# EAGLE design monroe-half-hi (EAGLE 6.3)
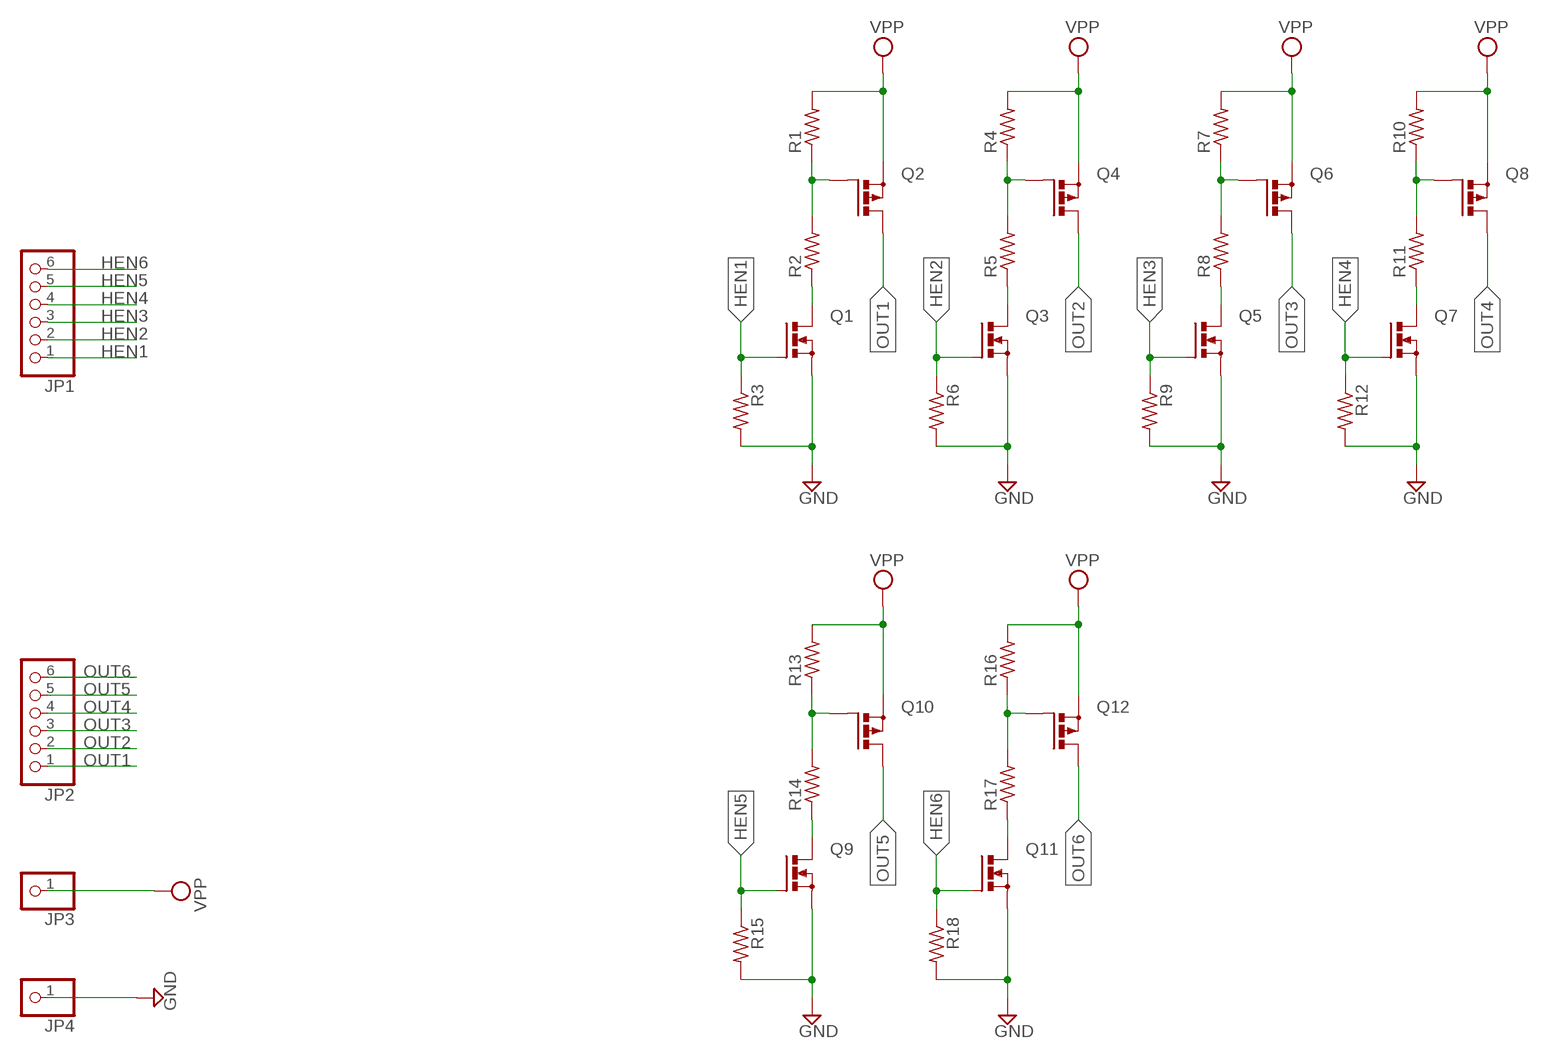
[diagram p0: schematic, sheet 1]

## Parts
JP1  PINHD-1X6  [1X06]
JP2  PINHD-1X6  [1X06]
JP3  PINHD-1X1  [1X01]
JP4  PINHD-1X1  [1X01]
Q1  PMOSFET_NTO220BV  [TO220BV]
Q2  PMOSFET_PTO220BV  [TO220BV]
Q3  PMOSFET_NTO220BV  [TO220BV]
Q4  PMOSFET_PTO220BV  [TO220BV]
Q5  PMOSFET_NTO220BV  [TO220BV]
Q6  PMOSFET_PTO220BV  [TO220BV]
Q7  PMOSFET_NTO220BV  [TO220BV]
Q8  PMOSFET_PTO220BV  [TO220BV]
Q9  PMOSFET_NTO220BV  [TO220BV]
Q10  PMOSFET_PTO220BV  [TO220BV]
Q11  PMOSFET_NTO220BV  [TO220BV]
Q12  PMOSFET_PTO220BV  [TO220BV]
R1  R-US_0207/5V  [0207/5V]
R2  R-US_0207/10  [0207/10]
R3  R-US_0207/5V  [0207/5V]
R4  R-US_0207/5V  [0207/5V]
R5  R-US_0207/10  [0207/10]
R6  R-US_0207/5V  [0207/5V]
R7  R-US_0207/5V  [0207/5V]
R8  R-US_0207/10  [0207/10]
R9  R-US_0207/5V  [0207/5V]
R10  R-US_0207/5V  [0207/5V]
R11  R-US_0207/10  [0207/10]
R12  R-US_0207/5V  [0207/5V]
R13  R-US_0207/5V  [0207/5V]
R14  R-US_0207/10  [0207/10]
R15  R-US_0207/5V  [0207/5V]
R16  R-US_0207/5V  [0207/5V]
R17  R-US_0207/10  [0207/10]
R18  R-US_0207/5V  [0207/5V]

## Nets
GND: JP4.1 Q1.S Q3.S Q5.S Q7.S Q9.S Q11.S R3.2 R6.2 R9.2 R12.2 R15.2 R18.2
HEN1: JP1.1 Q1.G R3.1
HEN2: JP1.2 Q3.G R6.1
HEN3: JP1.3 Q5.G R9.1
HEN4: JP1.4 Q7.G R12.1
HEN5: JP1.5 Q9.G R15.1
HEN6: JP1.6 Q11.G R18.1
N$1: Q2.G R1.1 R2.2
N$2: Q1.D R2.1
N$3: Q4.G R4.1 R5.2
N$4: Q3.D R5.1
N$5: Q6.G R7.1 R8.2
N$6: Q5.D R8.1
N$7: Q8.G R10.1 R11.2
N$8: Q7.D R11.1
N$9: Q10.G R13.1 R14.2
N$10: Q9.D R14.1
N$11: Q12.G R16.1 R17.2
N$12: Q11.D R17.1
OUT1: JP2.1 Q2.D
OUT2: JP2.2 Q4.D
OUT3: JP2.3 Q6.D
OUT4: JP2.4 Q8.D
OUT5: JP2.5 Q10.D
OUT6: JP2.6 Q12.D
VPP: JP3.1 Q2.S Q4.S Q6.S Q8.S Q10.S Q12.S R1.2 R4.2 R7.2 R10.2 R13.2 R16.2

## Library data of the parts
JP1 JP2 = pinhead:PINHD-1X6: PIN HEADER
JP3 JP4 = pinhead:PINHD-1X1: PIN HEADER
Q1 Q3 Q5 Q7 Q9 Q11 = transistor-power:PMOSFET_N: Power MOSFET N-Channel
Q2 Q4 Q6 Q8 Q10 Q12 = transistor-power:PMOSFET_P: Power MOSFET P-Channel
R1 R3 R4 R6 R7 R9 R10 R12 R13 R15 R16 R18 = rcl:R-US_: RESISTOR, American symbol
R2 R5 R8 R11 R14 R17 = resistor:R-US_: RESISTOR, American symbol

## Board
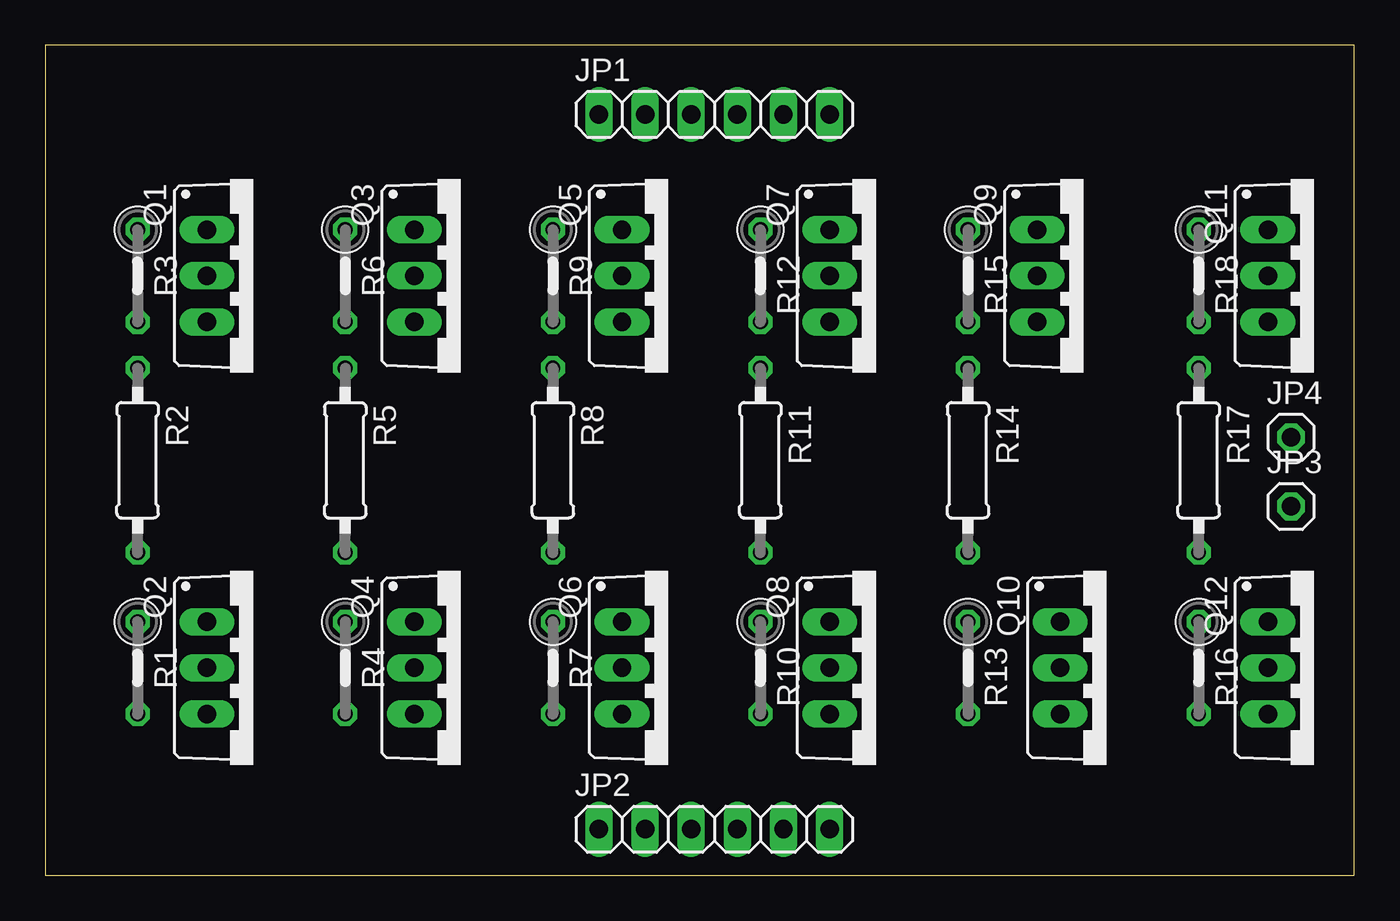
[diagram p1: board, top side]
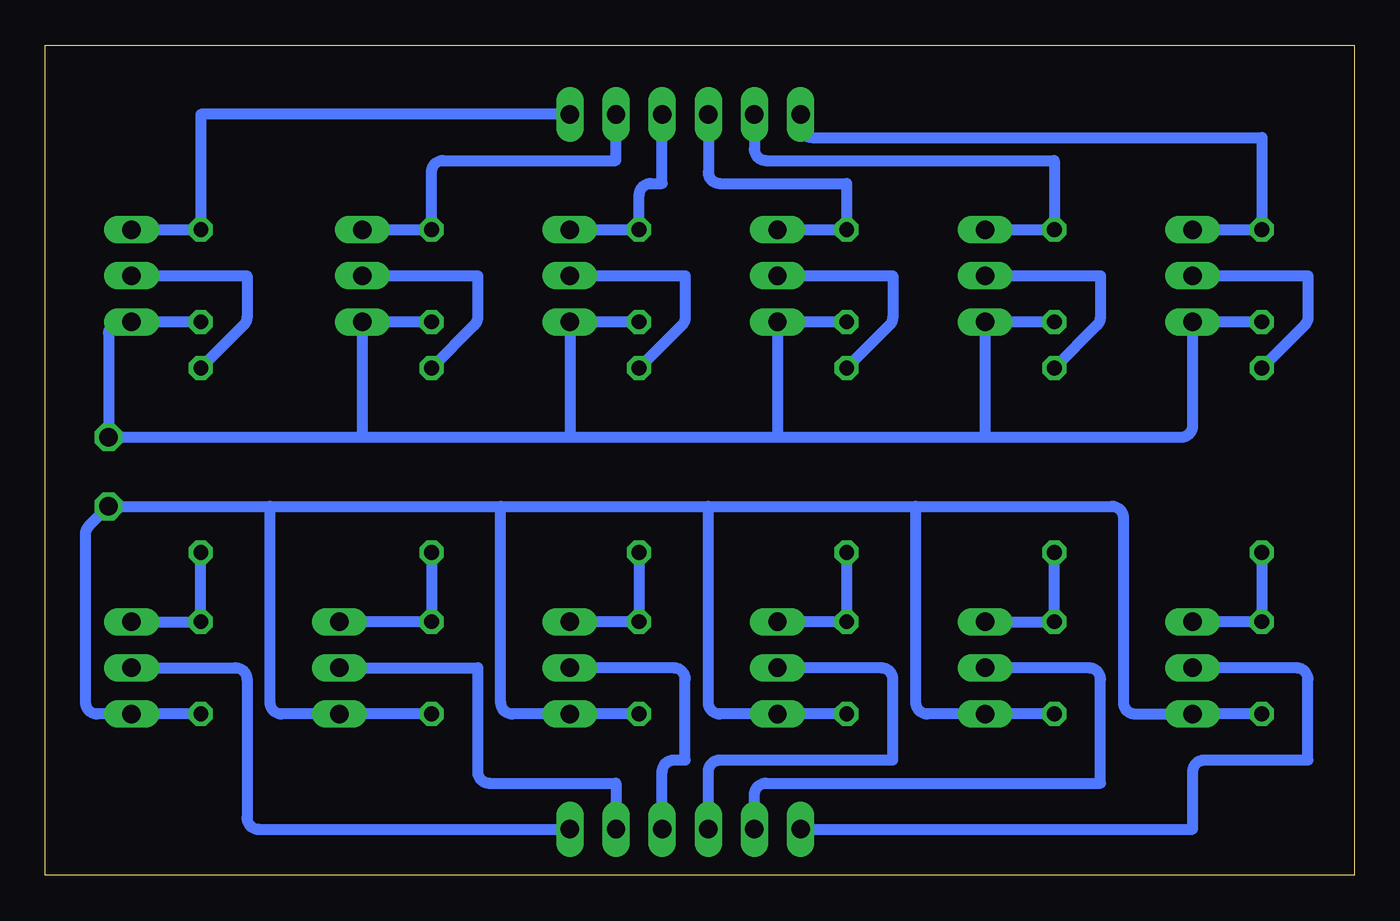
[diagram p2: board, bottom side, seen from below]

Size 72.06 x 45.71 mm. Coordinates in mm from the lower left corner, seen from the top.
Outline: 0,0 72.06,0 72.06,45.71 0,45.71 0,0
Copper layers (1*16): Top 0.035mm / dielectric 1.5mm / Bottom 0.035mm
Design rules "default": minimum track width 10mil, minimum drill 24mil, track to track 8mil, track to pad 8mil, pad to pad 8mil, via to via 8mil, smd to smd 8mil, copper to edge 40mil, drill to drill 8mil, minimum pad ring 10mil, minimum via ring 8mil, stop-mask expansion 4mil, vias tented up to drill 0mil, thermal gap 10mil

### Footprints (pad centres in the part's own frame; a part is rotated, then mirrored left to right if it is on the bottom)
1X06 = drill 1.016 long: 1 -6.35,0; 2 -3.81,0; 3 -1.27,0; 4 1.27,0; 5 3.81,0; 6 6.35,0
1X01 = drill 1.016 octagon: 1 0,0
TO220BV = drill 1.016 long: D 0,-2.54; G -2.54,-2.54; S 2.54,-2.54
0207/5V = drill 0.813 octagon: 1 -2.54,0; 2 2.54,0
0207/10 = drill 0.813 octagon: 1 -5.08,0; 2 5.08,0

### Placement (x,y rotation side)
JP1  36.83,41.91 0 top
JP2  36.83,2.54 0 top
JP3  68.58,20.32 0 top
JP4  68.58,24.13 0 top
Q1  11.43,33.02 270 top
Q2  11.43,11.43 270 top
Q3  22.86,33.02 270 top
Q4  22.86,11.43 270 top
Q5  34.29,33.02 270 top
Q6  34.29,11.43 270 top
Q7  45.72,33.02 270 top
Q8  45.72,11.43 270 top
Q9  57.15,33.02 270 top
Q10  58.42,11.43 270 top
Q11  69.85,33.02 270 top
Q12  69.85,11.43 270 top
R1  5.08,11.43 270 top
R2  5.08,22.86 270 top
R3  5.08,33.02 270 top
R4  16.51,11.43 270 top
R5  16.51,22.86 270 top
R6  16.51,33.02 270 top
R7  27.94,11.43 270 top
R8  27.94,22.86 270 top
R9  27.94,33.02 270 top
R10  39.37,11.43 270 top
R11  39.37,22.86 270 top
R12  39.37,33.02 270 top
R13  50.8,11.43 270 top
R14  50.8,22.86 270 top
R15  50.8,33.02 270 top
R16  63.5,11.43 270 top
R17  63.5,22.86 270 top
R18  63.5,33.02 270 top

### Tracks (layer width: path | path; a pad name or v marks a point on that pad's centre or on a via)
GND
  Bottom 0.61: 54.61,24.13 JP4.1 68.58,29.84 arc90 67.94,30.48 Q11.S R18.2 | 54.61,24.13 43.18,24.13 | 43.18,24.13 31.75,24.13 | 31.75,24.13 20.32,24.13 | 20.32,24.13 9.53,24.13 arc-90 8.89,24.77 Q1.S R3.2 | 20.32,24.13 Q3.S R6.2 | 31.75,24.13 Q5.S R9.2 | 43.18,24.13 Q7.S R12.2 | 54.61,24.13 Q9.S R15.2
HEN1
  Bottom 0.61: Q1.G R3.1 5.08,40.64 29.84,40.64 arc90 30.48,41.27 JP1.1
HEN2
  Bottom 0.61: Q3.G R6.1 16.51,39.37 32.38,39.37 arc90 33.02,40.01 JP1.2
HEN3
  Bottom 0.61: Q5.G R9.1 27.94,38.1 34.92,38.1 arc90 35.56,38.73 JP1.3
HEN4
  Bottom 0.61: Q7.G R12.1 39.37,37.47 arc90 38.73,38.1 38.1,38.1 JP1.4
HEN5
  Bottom 0.61: Q9.G R15.1 50.8,38.73 arc90 50.16,39.37 40.64,39.37 JP1.5
HEN6
  Bottom 0.61: Q11.G R18.1 63.5,41.91 JP1.6
N$1
  Bottom 0.61: R2.2 R1.1 Q2.G
N$2
  Bottom 0.61: Q1.D 2.54,33.02 2.54,30.74 arc45 2.73,30.29 R2.1
N$3
  Bottom 0.61: Q4.G R4.1 R5.2
N$4
  Bottom 0.61: Q3.D 13.97,33.02 13.97,30.74 arc45 14.16,30.29 R5.1
N$5
  Bottom 0.61: R8.2 R7.1 Q6.G
N$6
  Bottom 0.61: Q5.D 25.4,33.02 25.4,30.74 arc45 25.59,30.29 R8.1
N$7
  Bottom 0.61: R11.2 R10.1 Q8.G
N$8
  Bottom 0.61: Q7.D 36.83,33.02 36.83,30.74 arc45 37.02,30.29 R11.1
N$9
  Bottom 0.61: R14.2 R13.1 Q10.G
N$10
  Bottom 0.61: Q9.D 48.26,33.02 48.26,30.74 arc45 48.45,30.29 R14.1
N$11
  Bottom 0.61: R17.2 R16.1 Q12.G
N$12
  Bottom 0.61: Q11.D 60.96,33.02 60.96,30.74 arc45 61.15,30.29 R17.1
OUT1
  Bottom 0.61: JP2.1 8.89,2.54 8.89,5.71 arc90 8.26,6.35 2.54,6.35 2.54,10.79 arc-90 3.17,11.43 Q2.D
OUT2
  Bottom 0.61: JP2.2 33.02,4.45 arc90 32.38,5.08 13.97,5.08 13.97,10.79 arc-90 14.61,11.43 Q4.D
OUT3
  Bottom 0.61: JP2.3 35.56,5.71 arc90 34.92,6.35 25.4,6.35 25.4,10.79 arc-90 26.04,11.43 Q6.D
OUT4
  Bottom 0.61: JP2.4 38.1,5.71 arc90 37.47,6.35 36.83,6.35 36.83,10.79 arc-90 37.47,11.43 Q8.D
OUT5
  Bottom 0.61: Q10.D 48.26,11.43 48.26,5.71 arc-90 47.62,5.08 40.64,5.08 JP2.5
OUT6
  Bottom 0.61: Q12.D 61.59,11.43 arc90 60.96,10.79 60.96,3.17 arc-90 60.33,2.54 JP2.6
VPP
  Bottom 0.61: 59.69,20.32 JP3.1 69.66,19.24 arc-45 69.85,18.79 69.85,9.53 arc-90 69.22,8.89 Q12.S R16.2 | 59.69,20.32 46.99,20.32 | 46.99,20.32 35.56,20.32 | 35.56,20.32 24.13,20.32 | 24.13,20.32 13.34,20.32 arc90 12.7,19.68 12.7,9.53 arc-90 12.06,8.89 Q2.S R1.2 | 24.13,20.32 24.13,9.53 arc-90 23.5,8.89 Q4.S R4.2 | 35.56,20.32 35.56,9.53 arc-90 34.92,8.89 Q6.S R7.2 | 46.99,20.32 46.99,9.53 arc-90 46.35,8.89 Q8.S R10.2 | 59.69,20.32 59.69,9.53 arc-90 59.05,8.89 Q10.S R13.2